# EAGLE design Smart_Alarm (EAGLE 9.5.1)
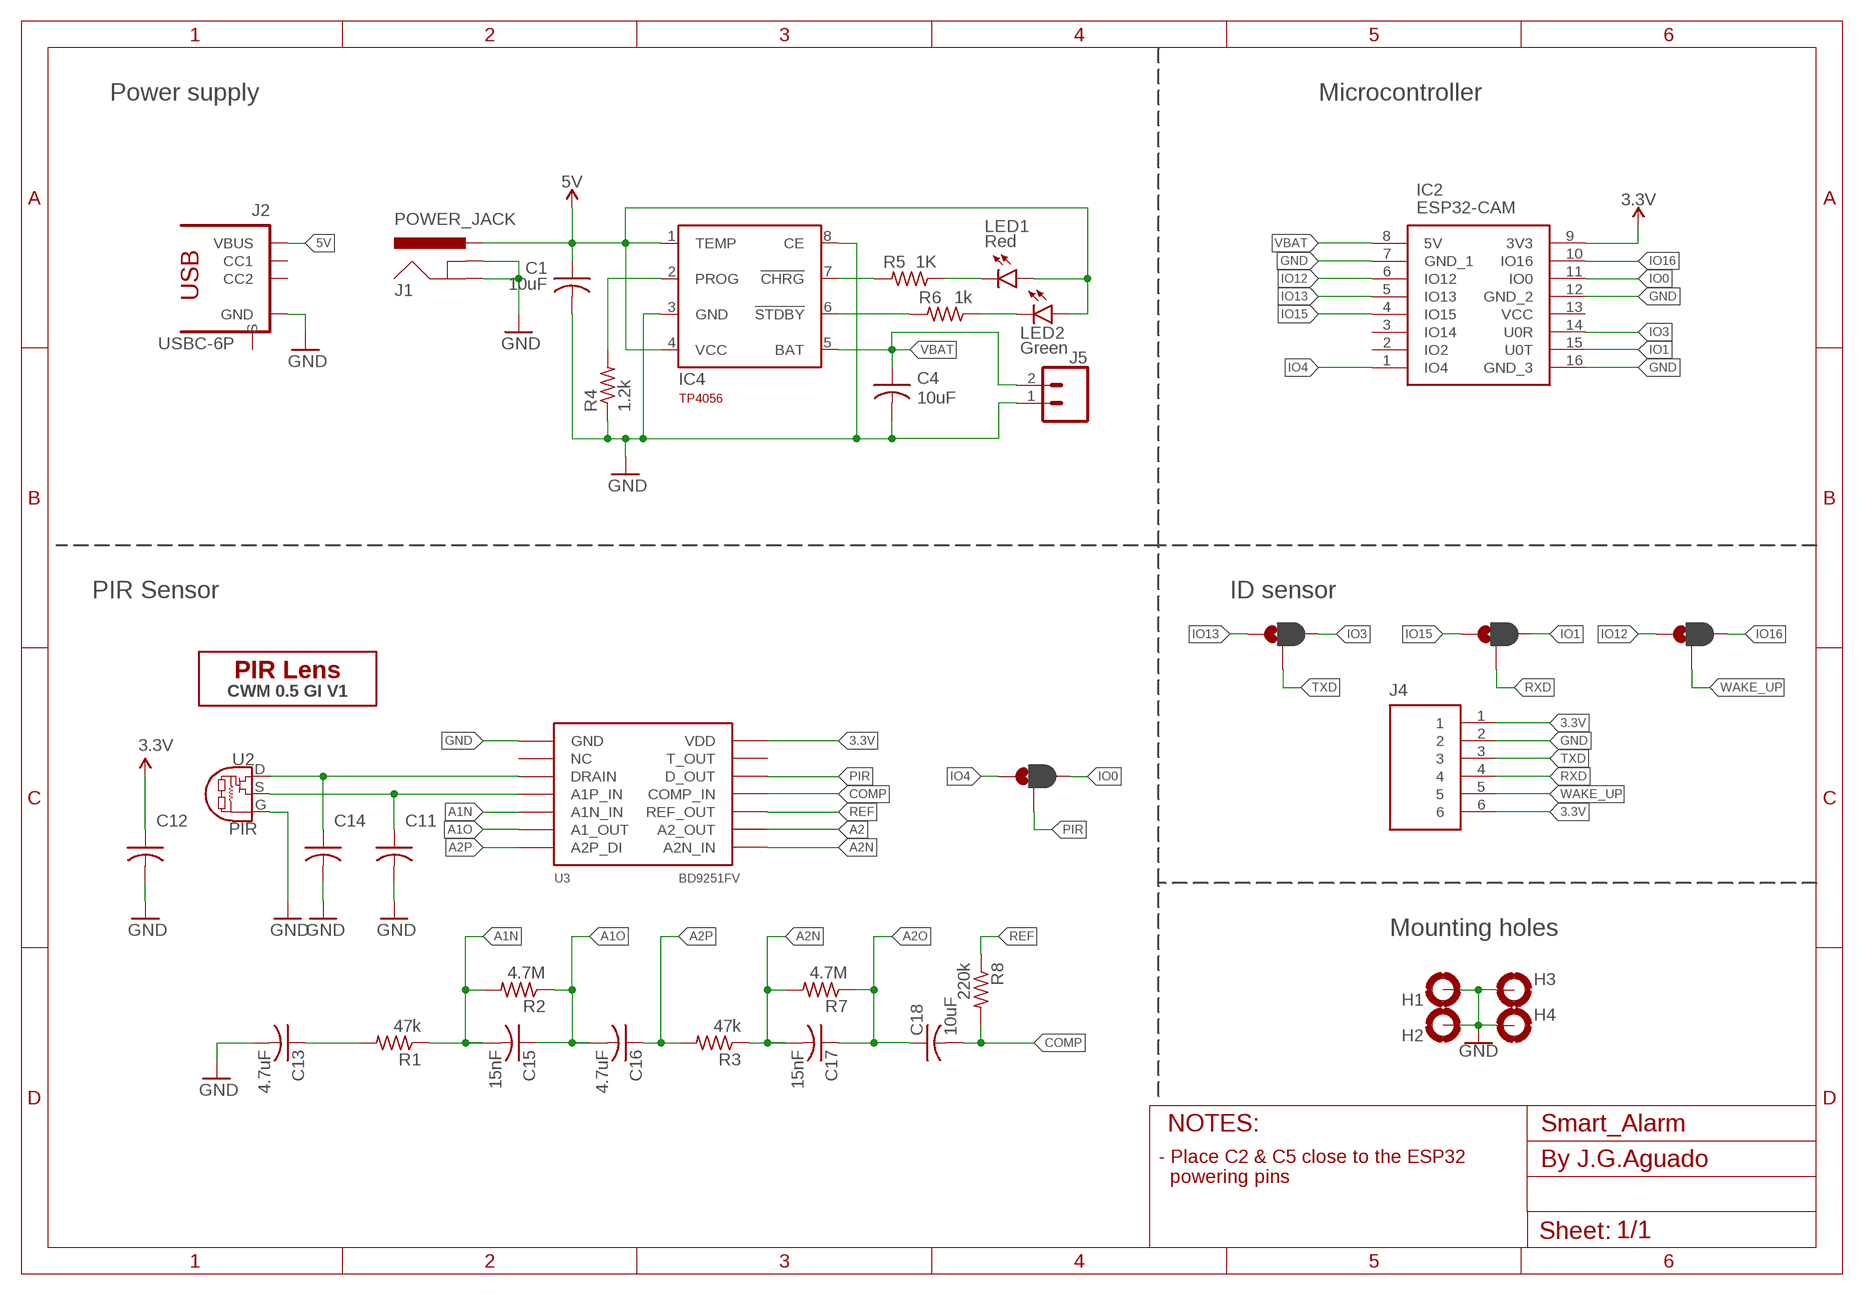
[diagram p0: schematic, sheet 1]

## Parts
C1  10uF  C-USC0603  [C0603]
C4  10uF  C-USC0603  [C0603]
C11  1.0uF  C-USC0603  [C0603]
C12  1.0uF  C-USC0603  [C0603]
C13  4.7uF  C-USC0603  [C0603]
C14  1.0uF  C-USC0603  [C0603]
C15  15nF  C-USC0603  [C0603]
C16  4.7uF  C-USC0603  [C0603]
C17  15nF  C-USC0603  [C0603]
C18  10uF  C-USC0603  [C0603]
H1  MOUNT-PAD-ROUND  [3,0-PAD]
H2  MOUNT-PAD-ROUND  [3,0-PAD]
H3  MOUNT-PAD-ROUND  [3,0-PAD]
H4  MOUNT-PAD-ROUND  [3,0-PAD]
IC2  ESP32-CAM  [ESP32CAM]
IC4  TP4056  [SOT23-8]
J1  POWER_JACK  [POWER_JACK_PTH]
J2  USBC-6P  [USCX-06FX-XXMX-01]
J4  JST_6_PIN_VERTICAL  [JST-6-SMD-VERT-1.0MM]
J5  CONN_02-JST-2-PTH-NO_SILK  [JST-2-PTH-NS]
JP1  JUMPER-SMT_3_1-NC_PASTE_NO-SILK  [SMT-JUMPER_3_1-NC_PASTE_NO-SILK]
JP2  JUMPER-SMT_3_1-NC_PASTE_NO-SILK  [SMT-JUMPER_3_1-NC_PASTE_NO-SILK]
JP3  JUMPER-SMT_3_1-NC_PASTE_NO-SILK  [SMT-JUMPER_3_1-NC_PASTE_NO-SILK]
JP4  JUMPER-SMT_3_1-NC_PASTE_NO-SILK  [SMT-JUMPER_3_1-NC_PASTE_NO-SILK]
LED1  Red  LED0603  [LED_0603]
LED2  Green  LED0603  [LED_0603]
R1  47k  R-US_R0603  [R0603]
R2  4.7M  R-US_R0603  [R0603]
R3  47k  R-US_R0603  [R0603]
R4  1.2k  R-US_R0603  [R0603]
R5  1K  R-US_R0603  [R0603]
R6  1k  R-US_R0603  [R0603]
R7  4.7M  R-US_R0603  [R0603]
R8  220k  R-US_R0603  [R0603]
U2  PIR  [PIR]
U3  BD9251FV  [TSSOP-14]
U$2  CWM 0.5 GI V1  PIR-LENSCWM-0.5-GI-V1  [LENS-CWM-0.5-GI-V1]

## Nets
3.3V: C12.1 IC2.9(3V3) J4.1 J4.6 U3.14(VDD)
5V: C1.1 IC4.1(TEMP) IC4.4(VCC) J1.PWR J2.VBUS1(VBUS) J2.VBUS2(VBUS) LED1.A LED2.A
A1N: C15.2 R1.1 R2.2 U3.5(A1N_IN)
A1O: C15.1 C16.2 R2.1 U3.6(A1_OUT)
A2: U3.9(A2_OUT)
A2N: C17.2 R3.1 R7.2 U3.8(A2N_IN)
A2O: C17.1 C18.1 R7.1
A2P: C16.1 R3.2 U3.7(A2P_DI)
COMP: C18.2 R8.2 U3.11(COMP_IN)
GND: C1.2 C4.2 C11.2 C12.2 C13.2 C14.2 H1.B3,0(MOUNT) H1.P$2(MOUNT) H1.P$3(MOUNT) H1.P$4(MOUNT) H1.P$5(MOUNT) H1.P$6(MOUNT) H1.P$7(MOUNT) H1.P$8(MOUNT) H1.P$9(MOUNT) H2.B3,0(MOUNT) H2.P$2(MOUNT) H2.P$3(MOUNT) H2.P$4(MOUNT) H2.P$5(MOUNT) H2.P$6(MOUNT) H2.P$7(MOUNT) H2.P$8(MOUNT) H2.P$9(MOUNT) H3.B3,0(MOUNT) H3.P$2(MOUNT) H3.P$3(MOUNT) H3.P$4(MOUNT) H3.P$5(MOUNT) H3.P$6(MOUNT) H3.P$7(MOUNT) H3.P$8(MOUNT) H3.P$9(MOUNT) H4.B3,0(MOUNT) H4.P$2(MOUNT) H4.P$3(MOUNT) H4.P$4(MOUNT) H4.P$5(MOUNT) H4.P$6(MOUNT) H4.P$7(MOUNT) H4.P$8(MOUNT) H4.P$9(MOUNT) IC2.7(GND_1) IC2.12(GND_2) IC2.16(GND_3) IC4.3(GND) IC4.8(CE) J1.GND J1.GNDBREAK J2.GND1(GND) J2.GND2(GND) J4.2 J5.1 R4.1 U2.G U3.1(GND)
IO0: IC2.11(IO0) JP4.3
IO1: IC2.15(U0T) JP2.3
IO3: IC2.14(U0R) JP1.3
IO4: IC2.1(IO4) JP4.1
IO12: IC2.6(IO12) JP3.1
IO13: IC2.5(IO13) JP1.1
IO15: IC2.4(IO15) JP2.1
IO16: IC2.10(IO16) JP3.3
N$1: LED1.C R5.1
N$2: IC4.6(!STDBY) R6.2
N$4: LED2.C R6.1
N$5: IC4.2(PROG) R4.2
N$6: IC4.7(!CHRG) R5.2
N$9: C11.1 U2.S U3.4(A1P_IN)
N$10: C14.1 U2.D U3.3(DRAIN)
N$11: C13.1 R1.2
PIR: JP4.2 U3.12(D_OUT)
REF: R8.1 U3.10(REF_OUT)
RXD: J4.4 JP2.2
TXD: J4.3 JP1.2
VBAT: C4.1 IC2.8(5V) IC4.5(BAT) J5.2
WAKE_UP: J4.5 JP3.2
Unconnected: IC2.2(IO2) IC2.3(IO14) IC2.13(VCC) J2.CC1 J2.CC2 J2.SHIELD1(S) J2.SHIELD2(S) J2.SHIELD3(S) J2.SHIELD4(S) U3.2(NC) U3.13(T_OUT)

## Notes on the sheet
- Power supply | Microcontroller
- PIR Sensor | ID sensor
- Mounting holes
- - Place C2 & C5 close to the ESP32
    powering pins

## Library data of the parts
C1 C4 C11-C18 = rcl:C-US: CAPACITOR, American symbol; SPICEPREFIX: C
H1-H4 = SpaceDIY_connectors:MOUNT-PAD-ROUND: MOUNTING PAD, round
IC2 = SamacSys_Parts:ESP32-CAM: Modules PCBA Module RoHS Source: Datasheet <https://datasheet.lcsc.com/szlcsc/Ai-Thinker-ESP32-CAM_C277946.pdf>; DESCRIPTION: Modules PCBA Module RoHS; HEIGHT: 5mm; MANUFACTURER_NAME: Ai-Thinker; MANUFACTURER_PART_NUMBER: ESP32-CAM
IC4 = TP4056:TP4056: TP4056 Data sheet <http://goo.gl/J7k8TF> Dave.Calaway Eagle Library <https://goo.gl/Muy1Tr>
J1 = SparkFun-Connectors:POWER_JACK: Power Jack Connector This is the standard 5.5mm barrel jack for power. The PTH is the most common, proven, reliable, footprint. The Slot footprint only works if the mill layer is transmitted to the PCB fab house so be warned. Here are the connectors we sell at SparkFun: DC Barrel Power Jack/Connector <https://www.sparkfun.com/products/119> (PRT-00119) DC Barrel Power Jack/Connector (SMD) <https://www.sparkfun.com/products/12748> (PRT-12748) DC Barrel Jack Adapter - Breadboard Compatible <https://www.sparkfun.com/products/10811> (PRT-10811) It is used on this SparkFun product (and many, many others): SparkFun RedBoard - Programmed with Arduino <https://www.sparkfun.com/products/12757> (DEV-12757) Also, if you need a mating power supply or connector, please check these out: Wall Adapter Power Supply - 9VDC 650mA <https://www.sparkfun.com/products/298> (TOL-00298) DC Barrel Jack Adapter - Male <https://www.sparkfun.com/products/10287> (PRT-10287); PROD_ID: CONN-08197
J2 = SpaceDIY_connectors:USBC-6P: AliExpress Special! Connect 5.1k 10% resistors to each CC pin, pulled up to 3.3v or 5.0v.
J4 = SparkFun-Connectors:JST_6_PIN_VERTICAL: JST 6 pin vertical connector Here is a six pin vertical 1.0mm pitch connector. It is useful if you need something very tiny as a connection. These are not the standard JST type connectors we use on most of our boards, but are actually the much smaller JST-SH type. Here is the connector we sell at SparkFun: JST SH Vertical 6-Pin Connector - SMD <https://www.sparkfun.com/products/579> (GPS-00579) Datasheet <http://www.sparkfun.com/datasheets/GPS/EM406-SMDConnector-eSH.pdf> It was used on these SparkFun products: SparkFun GPS Breakout <https://www.sparkfun.com/products/11818> (BOB-11818) SparkFun Weather Shield <https://www.sparkfun.com/products/12081> (DEV-12081) And many, many other GPS related products.; PROD_ID: CONN-08249; SF_ID: GPS-00579
J5 = SparkFun-Connectors:CONN_02: Multi connection point. Often used as Generic Header-pin footprint for 0.1 inch spaced/style header connections On any of the 0.1 inch spaced packages, you can populate with these: Break Away Headers - Straight <https://www.sparkfun.com/products/116> (PRT-00116) Break Away Male Headers - Right Angle <https://www.sparkfun.com/products/553> (PRT-00553) Female Headers <https://www.sparkfun.com/products/115> (PRT-00115) Break Away Headers - Machine Pin <https://www.sparkfun.com/products/117> (PRT-00117) Break Away Female Headers - Swiss Machine Pin <https://www.sparkfun.com/products/743> (PRT-00743) For SCREWTERMINALS and SPRING TERMINALS visit here: Screw Terimnals on SparkFun.com <https://www.sparkfun.com/search/results?term=Screw+Terminals> (5mm/3.5mm/2.54mm spacing) This device is also useful as a general connection point to wire up your design to another part of your project. Our various solder wires solder well into these plated through hole pads. Hook-Up Wire - Assortment (Stranded, 22 AWG) <https://www.sparkfun.com/products/11375> (PRT-11375) Hook-Up Wire - Assortment (Solid Core, 22 AWG) <https://www.sparkfun.com/products/11367> (PRT-11367) View the entire wire category on our website here <https://www.sparkfun.com/categories/141> Special notes: Molex polarized connector foot print use with: PRT-08233 with associated crimp pins and housings. 2.54_SCREWTERM for use with PRT-10571. 3.5mm Screw Terminal footprints for PRT-08084 5mm Screw Terminal footprints for use with PRT-08432
JP1-JP4 = SparkFun-Jumpers:JUMPER-SMT_3_1-NC_PASTE: Normally closed solder jumper (1 of 2 connections) This jumper has an aperture in the stencil to allow solder paste to bridge one of the two connections. One connection is normally closed (NC), while the other is normally open (NO). Wick off the solder to open the connection. Reapply solder to reclose the connection. Apply solder to the other side instead to change the current path.
LED1 LED2 = SpaceDIY_semiconductors:LED: LED (Generic) Standard schematic elements and footprints for 5mm, 3mm, 0402, 0603 , 0805 and 1206 sized LEDs. Generic LEDs with no color specified.
R1-R8 = rcl:R-US_: RESISTOR, American symbol; SPICEPREFIX: R
U2 = openPIR-temp:PIR; PROD_ID: IC-13430
U3 = SpaceDIY_IC:BD9251FV: Amplifier for Pyroelectric Infrared Sensor
U$2 = openPIR-temp:PIR-LENS

## Net classes
2 analog: width 0.203 mm, drill 0.33 mm, clearance 0.152 mm

## Board
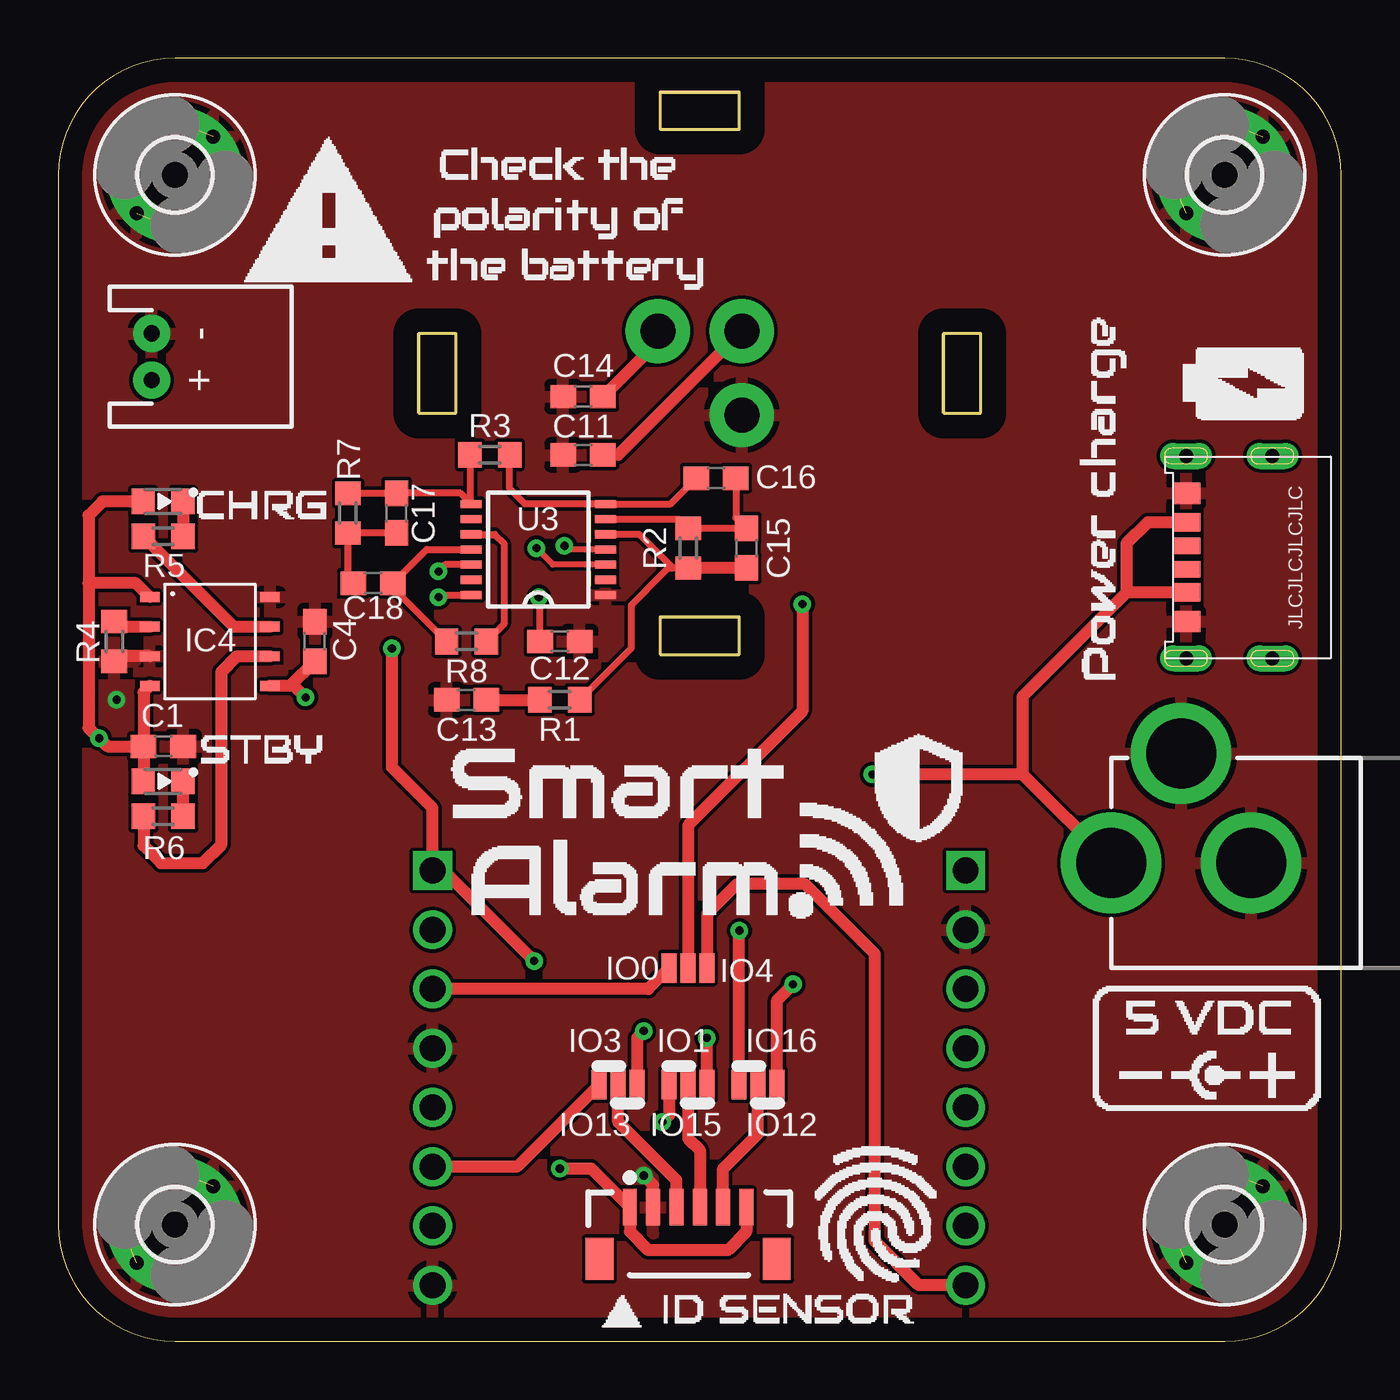
[diagram p1: board, top side]
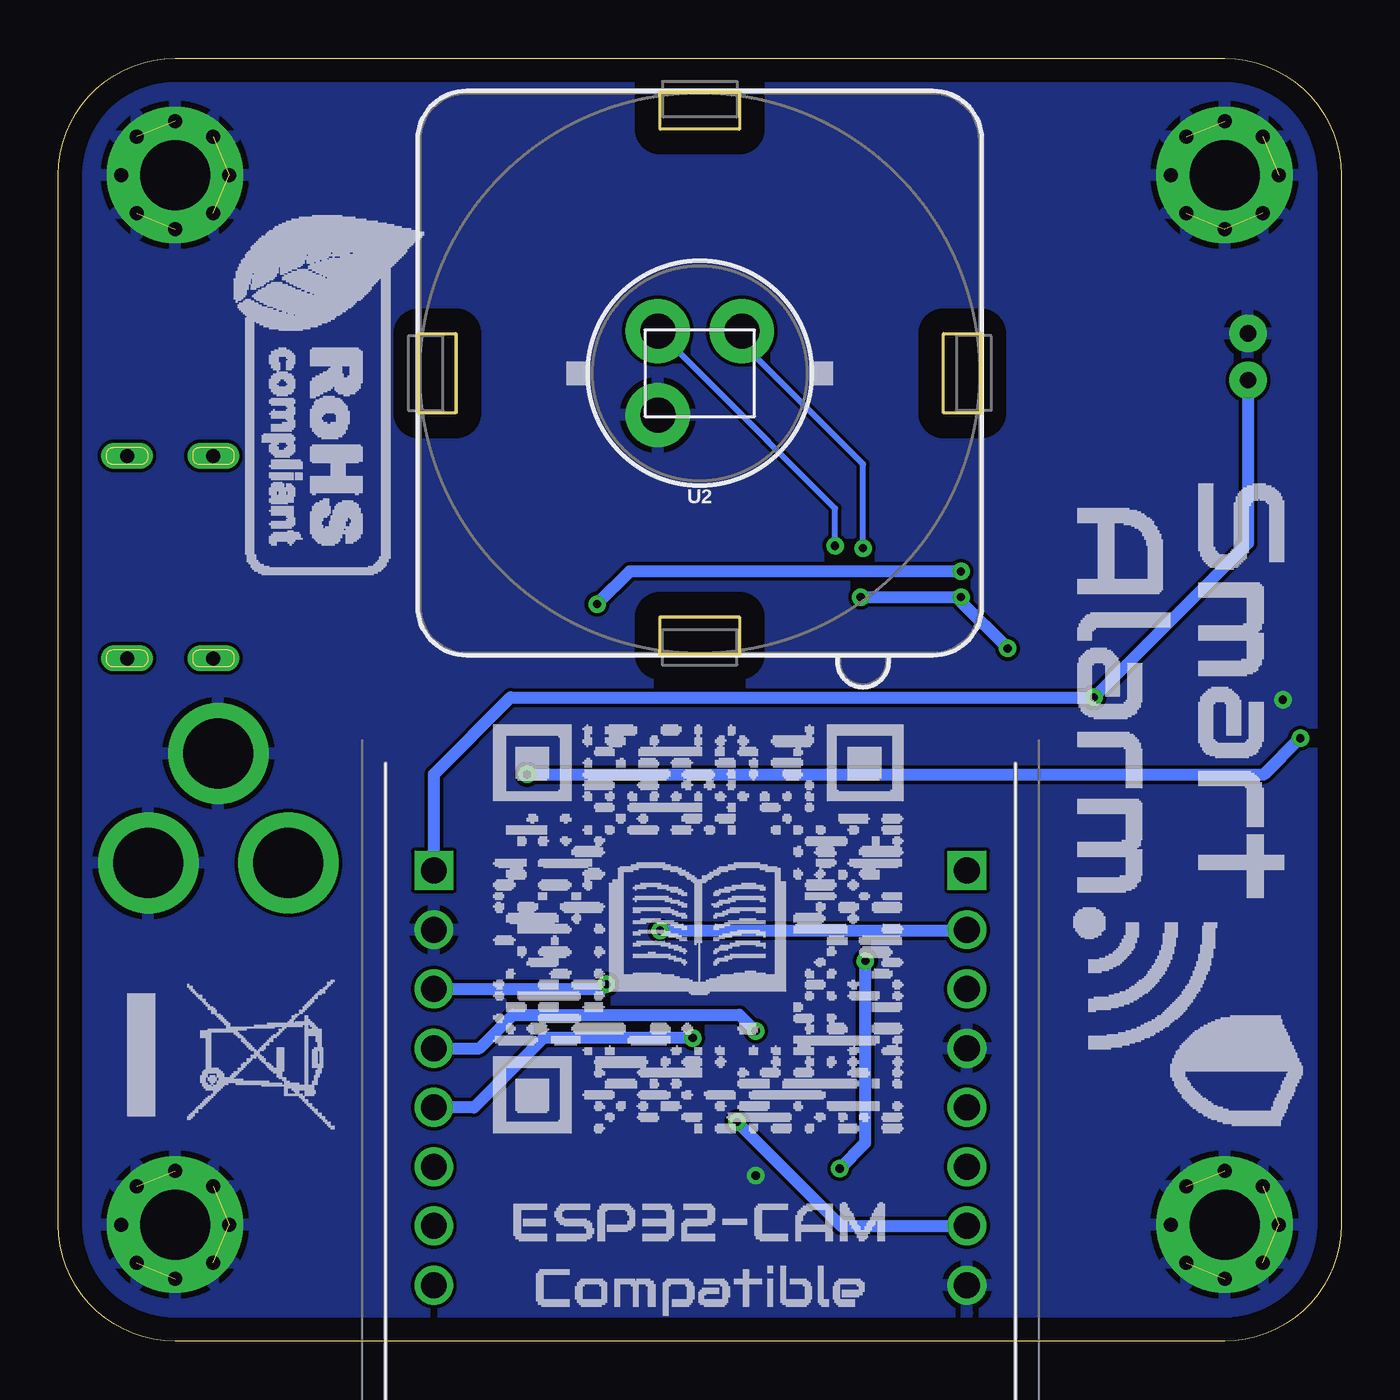
[diagram p2: board, bottom side, seen from below]

Size 55 x 55 mm. Coordinates in mm from the lower left corner, seen from the top.
Outline: 5,55 arc90 0,50 0,5 arc90 5,0 50,0 arc90 55,5 55,50 arc90 50,55 5,55
Copper layers (1*16): Top 0.035mm / dielectric 1.5mm / Bottom 0.035mm
Design rules "default": minimum track width 6mil, minimum drill 0.35mm, track to track 6mil, track to pad 6mil, pad to pad 6mil, via to via 6mil, smd to smd 6mil, copper to edge 40mil, drill to drill 6mil, minimum pad ring 10mil, minimum via ring 8mil, stop-mask expansion 4mil, vias tented up to drill 0mil, thermal gap 10mil

### Footprints (pad centres in the part's own frame; a part is rotated, then mirrored left to right if it is on the bottom)
C0603 = smd 1.1 x 1: 1 -0.85,0; 2 0.85,0
3,0-PAD = drill 3 pad 5.842: B3,0 0,0 | drill 0.6: P$2 0,2.31; P$3 1.638,1.634; P$4 2.318,-0.003; P$5 1.642,-1.64; P$6 0.005,-2.32; P$7 -1.633,-1.644; P$8 -2.313,-0.008; P$9 -1.636,1.63
ESP32CAM = drill 1.11 pad 1.665: 1 0,0; 2 0,2.54; 3 0,5.08; 4 0,7.62; 5 0,10.16; 6 0,12.7; 7 0,15.24; 10 22.86,15.24; 11 22.86,12.7; 12 22.86,10.16; 13 22.86,7.62; 14 22.86,5.08; 15 22.86,2.54; 16 22.86,0 | drill 1.11 pad 1.665 square: 8 0,17.78; 9 22.86,17.78
SOT23-8 = smd 0.42 x 0.835: 1 -1.905,-2.58; 2 -0.635,-2.58; 3 0.635,-2.58; 4 1.905,-2.58; 5 1.905,2.58; 6 0.635,2.58; 7 -0.635,2.58; 8 -1.905,2.58
POWER_JACK_PTH = drill 2.997 pad 4.318: GND 0,7.7; GNDBREAK 4.7,10.7; PWR 0,13.7
USCX-06FX-XXMX-01 = smd 0.7 x 1.2: CC1 0.5,-1.75; CC2 -0.5,-1.75 | smd 0.9 x 1.2: GND1 2.75,-1.75; GND2 -2.75,-1.75 | drill 0.6 long: SHIELD1 4.325,1.95; SHIELD2 4.325,-1.75; SHIELD3 -4.35,-1.75; SHIELD4 -4.35,1.95 | smd 0.8 x 1.2: VBUS1 1.5,-1.75; VBUS2 -1.5,-1.75
JST-6-SMD-VERT-1.0MM = smd 0.6 x 1.55: 1 -2.54,1.27; 2 -1.54,1.27; 3 -0.54,1.27; 4 0.46,1.27; 5 1.46,1.27; 6 2.46,1.27 | smd 1.2 x 1.8: P$1 -3.84,-0.955; P$2 3.76,-0.955
JST-2-PTH-NS = drill 0.7 pad 1.6: 1 -1,0; 2 1,0
SMT-JUMPER_3_1-NC_PASTE_NO-SILK = smd 0.635 x 1.27: 1 -0.813,0; 2 0,0; 3 0.813,0
LED_0603 = smd 1 x 1.1: A -0.86,0; C 0.84,0
R0603 = smd 1 x 1.1: 1 -0.85,0; 2 0.85,0
PIR = drill 1.5 pad 2.75: D -1.8,-1.8; G 1.8,1.8; S 1.8,-1.8
TSSOP-14 = smd 0.9 x 0.35: 1 -2.955,2.01; 2 -2.955,1.36; 3 -2.955,0.71; 4 -2.955,0.06; 5 -2.955,-0.59; 6 -2.955,-1.24; 7 -2.955,-1.89; 8 2.795,-1.89; 9 2.795,-1.24; 10 2.795,-0.59; 11 2.795,0.06; 12 2.795,0.71; 13 2.795,1.36; 14 2.795,2.01

### Placement (x,y rotation side)
C1  4.5,25.5 0 top
C4  11,30 90 top
C11  22.5,38 180 top
C12  21.5,30 0 top
C13  17.5,27.5 180 top
C14  22.5,40.5 180 top
C15  29.5,34 270 top
C16  28.2,37 0 top
C17  14.5,35.5 90 top
C18  13.5,32.5 0 top
H1  5,50 270 top
H2  50,50 270 top
H3  5,5 270 top
H4  50,5 270 top
IC2  38.9,2.4 0 bottom
IC4  6.5,30 270 top
J1  58.84,20.5 90 top
J2  50.1,33.6 270 top
J4  27.04,4.48 0 top
J5  4,42.2 270 top
JP1  24,11 180 top
JP2  27,11 180 top
JP3  30,11 180 top
JP4  27,16 180 top
LED1  4.5,36 0 top
LED2  4.5,24 0 top
R1  21.5,27.5 180 top
R2  27,34 270 top
R3  18.5,38 0 top
R4  2.4,30 90 top
R5  4.5,34.5 180 top
R6  4.5,22.5 180 top
R7  12.42,35.5 90 top
R8  17.5,30 180 top
U2  27.5,41.5 180 bottom
U3  20.5,34 180 top
U$2  27.5,41.5 180 bottom

### Tracks (layer width: path | path; a pad name or v marks a point on that pad's centre or on a via)
3.3V  (via drill 0.35)
  Top 0.305: C12.1 20.65,31.85 v20.6,31.9 | v16.3,31.9 16.39,31.99 U3.14
  Top 0.508: v14.3,29.7 14.3,24.6 16.04,22.86 IC2.9 16.52,20.18 v20.4,16.3 | J4.6 29.5,4.7 28.7,3.9 25.3,3.9 24.5,4.7 J4.1 22.85,7.4 v21.5,7.4
  Bottom 0.508: v14.3,29.7 16.3,31.7 v16.3,31.9 v20.6,31.9 | v21.5,7.4 20.4,8.5 v20.4,16.3
5V  (via drill 0.35)
  Top 0.508: IC4.1 3.33,32.5 1.3,32.5 | LED1.A 1.9,36 1.3,35.4 1.3,32.5 | 1.3,32.5 1.3,26.3 v1.75,25.85 2.1,25.5 C1.1 | C1.1 LED2.A | IC4.4 3.65,27.82 C1.1 | J1.PWR 41.34,24.3 | 41.34,24.3 v34.9,24.3 | J2.VBUS1 45.8,32.1 | 41.34,24.3 41.34,27.64 45.8,32.1 | J2.VBUS2 46.7,35.1 45.8,34.2 45.8,32.1
  Bottom 0.508: v34.9,24.3 3.3,24.3 v1.75,25.85
A1N
  Top 0.305: R1.1 24.57,29.72 24.57,31.56 25.2,32.19 25.2,32.2 26.15,33.15 26.35,33.15 | R2.2 26.35,33.15 | U3.5 24.91,34.59 26.35,33.15
  Top 0.508: C15.2 R2.2
A1O
  Top 0.305: U3.6 26.61,35.24 R2.1 C15.1 29.05,35.3 C16.2
A2N
  Top 0.305: R3.1 17.65,35.95 U3.8 17.25,36.35 C17.2 R7.2
A2O
  Top 0.305: C18.1 12.42,32.73 R7.1 C17.1
A2P
  Top 0.305: C16.1 26.24,35.89 U3.7 20.01,35.89 19.35,36.55 R3.2
COMP
  Top 0.305: U3.11 15.79,33.94 C18.2 14.35,32.3 R8.2
GND  (via drill 0.35)  (16 unrouted)
  Top 0.508: IC4.3 2.62,29.36 R4.1 | J4.2 25.5,6.7 v25.1,7.1
  other vias: 2.5,27.5
  pour Top: 55,50 arc90 50,55 5,55 arc90 0,50 0,5 arc90 5,0 50,0 arc90 55,5
  pour Bottom: 55,50 arc90 50,55 5,55 arc90 0,50 0,5 arc90 5,0 50,0 arc90 55,5
IO0
  Top 0.508: JP4.3 25.29,15.1 IC2.11
IO1  (via drill 0.35)
  Top 0.508: JP2.3 26.19,9.69 v25.9,9.4
  Bottom 0.508: v25.9,9.4 21.44,4.94 IC2.15
IO3
  Top 0.508: JP1.3 19.67,7.48 IC2.14
IO4
  Top 0.508: IC2.1 36.9,2.4 35,4.3 35,16.6 32,19.6 29.1,19.6 27.81,18.31 JP4.1
IO12  (via drill 0.35)
  Top 0.508: JP3.1 30.81,14.61 v31.5,15.3
  Bottom 0.508: IC2.6 31.7,15.1 v31.5,15.3
IO13  (via drill 0.35)
  Top 0.508: v25.1,13.3 24.81,13.01 JP1.1
  Bottom 0.508: IC2.5 36.94,12.56 35.5,14 25.8,14 v25.1,13.3
IO15  (via drill 0.35)
  Top 0.508: JP2.1 27.81,12.99 v27.8,13
  Bottom 0.508: v27.8,13 34.2,13 37.18,10.02 IC2.4
IO16  (via drill 0.35)
  Top 0.508: JP3.3 29.19,17.59 v29.2,17.6
  Bottom 0.508: v29.2,17.6 16.08,17.6 IC2.10
N$1
  Top 0.508: LED1.C R5.1
N$2
  Top 0.508: R6.2 3.65,21.25 4.4,20.5 6.2,20.5 7,21.3 7,28.7 7.67,29.36 IC4.6
N$4
  Top 0.508: LED2.C R6.1
N$5
  Top 0.508: R4.2 2.62,30.64 IC4.2
N$6
  Top 0.508: R5.2 7.51,30.64 IC4.7
N$9  (via drill 0.35)
  Top 0.254: U3.4 21.86,33.94 v21.7,34.1
  Top 0.508: U2.S 24,38 C11.1
  Bottom 0.254: v21.7,34.1 21.7,35.7 24.55,38.55 24.65,38.65 U2.S
N$10  (via drill 0.35)
  Top 0.254: U3.3 21.21,33.29 v20.5,34
  Top 0.508: C14.1 25.7,42.85 U2.D
  Bottom 0.254: v20.5,34 20.5,37.6 25.7,42.8 U2.D
N$11
  Top 0.508: C13.1 R1.2
PIR  (via drill 0.35)
  Top 0.305: U3.12 16.59,33.29 v16.3,33
  Top 0.508: v31.9,31.6 31.9,27 27,22.1 JP4.2
  Bottom 0.508: v16.3,33 30.5,33 v31.9,31.6
REF
  Top 0.305: U3.10 18.71,34.59 19.1,34.2 19.1,30.75 R8.1
RXD
  Top 0.508: JP2.2 27,8.7 27.5,8.2 J4.4
TXD
  Top 0.508: J4.3 26.5,6.9 24,9.4 JP1.2
VBAT  (via drill 0.35)
  Top 0.508: C4.1 9.95,28.09 | 9.95,28.09 IC4.5 | v10.6,27.6 10.11,28.09 9.95,28.09
  Bottom 0.508: J5.2 4,34.2 v10.6,27.6 35.6,27.6 38.9,24.3 IC2.8
WAKE_UP
  Top 0.508: J4.5 28.5,7.4 30,8.9 JP3.2

### Text on the board
tNames: JLCJLCJLCJLC | IO0 | IO4 | IO3 | IO1 | IO16 | IO13 | IO15 | IO12